# Altium schematic sheet Search Light V1.0.SchDoc
size A4
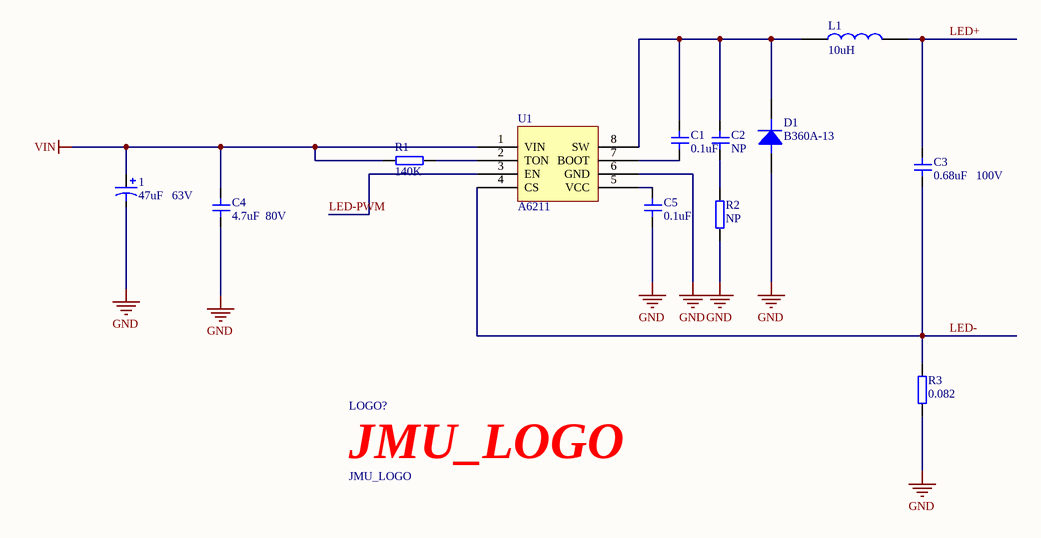
[diagram p0: Search Light V1.0.SchDoc]

## Parts
1  47uF   63V  [RB.1.2]
C1  0.1uF  [0805C]
C2  NP  [0805C]
C3  0.68uF   100V  [0805C]
C4  4.7uF  80V  [0805C]
C5  0.1uF  [0805C]
D1  B360A-13  [SMA/DO-214AC]
L1  10uH  [电感 220uh]
LOGO?  JMU_LOGO  [JMU_LOGO(1.35cm)]
R1  140K  [0805R]
R2  NP  [0805R]
R3  0.082  [0805R]
U1  A6211  [SOP-8]

## Nets
GND: 1.2 C4.1 C5.1 D1.1 R2.1 R3.1 U1.6(GND)
VIN: 1.1 C4.2 R1.1 U1.1(VIN)
LED+: C3.2 L1.2
LED-: C3.1 R3.2 U1.4(CS)
LED-PWM: U1.3(EN)
NetC1_1: C1.1 U1.7(BOOT)
NetC1_2: C1.2 C2.2 D1.2 L1.1 U1.8(SW)
NetC2_1: C2.1 R2.2
NetC5_2: C5.2 U1.5(VCC)
NetR1_2: R1.2 U1.2(TON)

## Library data of the parts
1 = Cap3: 直插极性电容
C1-C5 = Cap1: 无极贴片电容
D1 = Diode: 二极管
L1 = L: 电感
LOGO? = JMU_LOGO: LOGO
R1-R3 = Res: 电阻